# Altium schematic sheet Sheet1.SchDoc
size A3; SheetNumber: 1; SheetTotal: 1
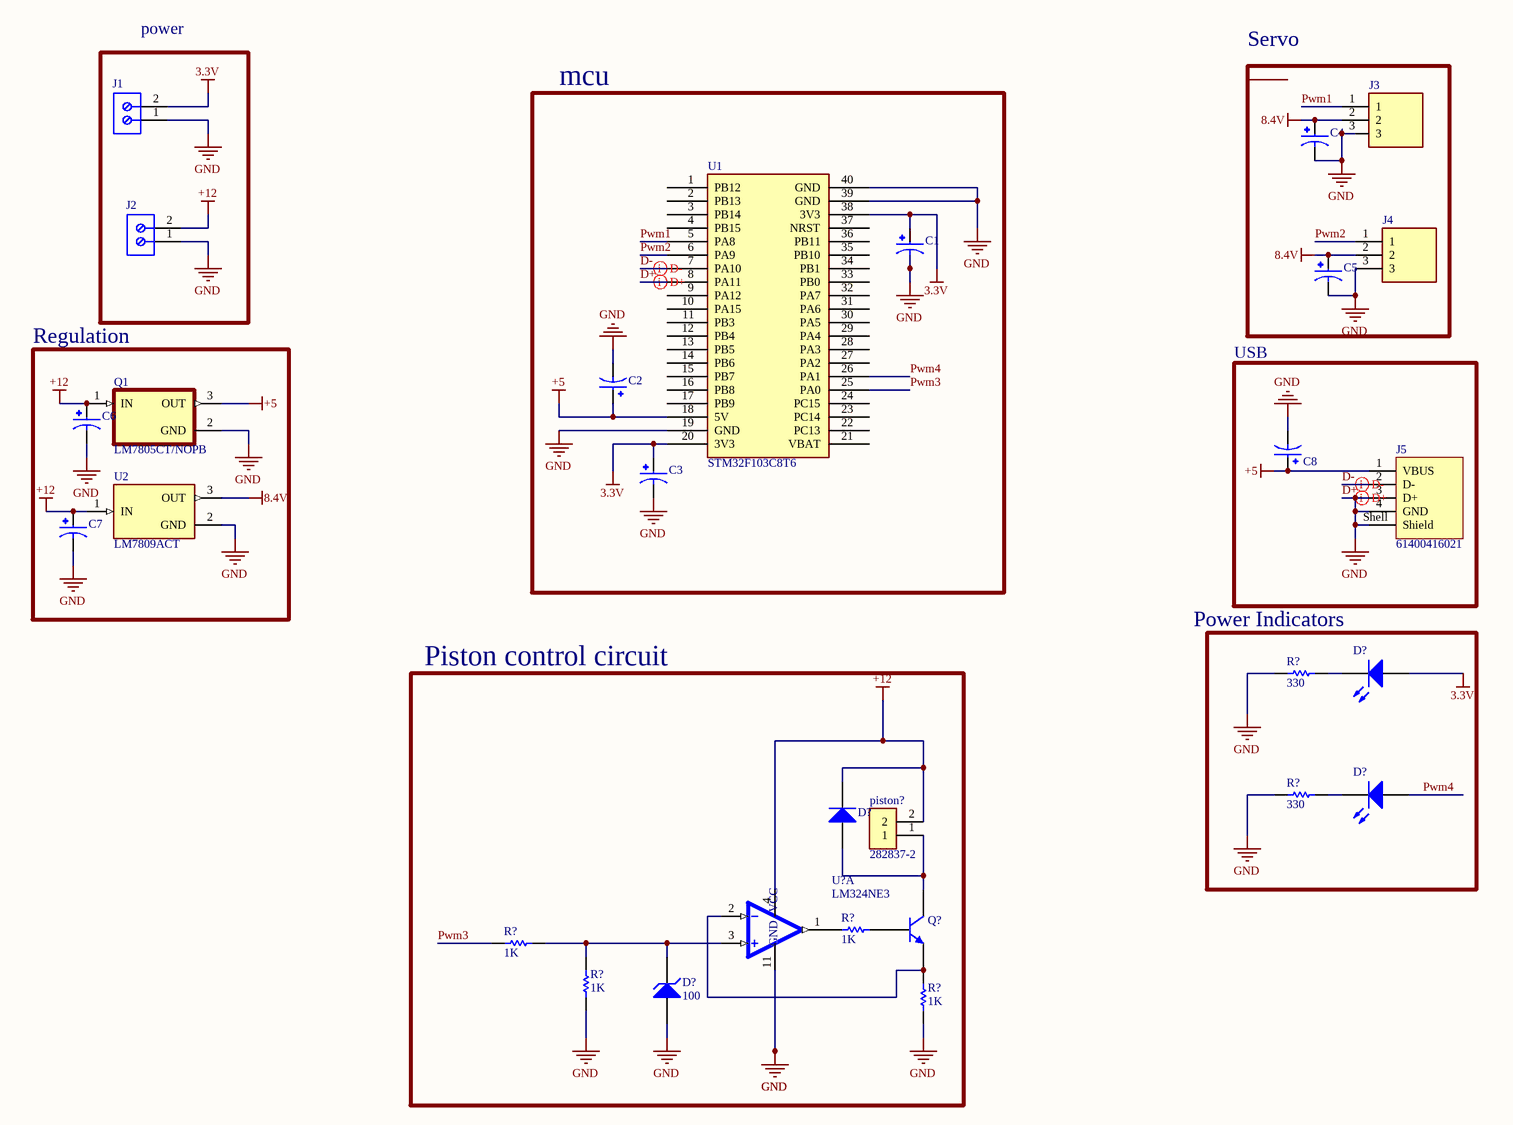
[diagram p0: Sheet1.SchDoc]

## Parts
(Parts that share a designator on the sheet are numbered #1, #2 ... from top to bottom, then left to right.)
C1  EEUFS1J270B  [CAPPRD500W50D500H1100]  (value not drawn)
C2  EEUFS1J270B  [CAPPRD500W50D500H1100]  (value not drawn)
C3  EEUFS1J270B  [CAPPRD500W50D500H1100]  (value not drawn)
C4  EEUFS1J270B  [CAPPRD500W50D500H1100]  (value not drawn)
C5  EEUFS1J270B  [CAPPRD500W50D500H1100]  (value not drawn)
C6  EEUFS1J270B  [CAPPRD500W50D500H1100]  (value not drawn)
C7  EEUFS1J270B  [CAPPRD500W50D500H1100]  (value not drawn)
C8  EEUFS1J270B  [CAPPRD500W50D500H1100]  (value not drawn)
D?#1  Light-Emitting Diode  (value not drawn)
D?#2  Light-Emitting Diode  (value not drawn)
D?#3  Diode  (value not drawn)
D?#4  BV: 100  (hidden comment: Zener Diode)
J1  691214110002  [691214110002]  (value not drawn)
J2  691214110002  [691214110002]  (value not drawn)
J3  TB006-508-03BE  [CUI_TB006-508-03BE]  (value not drawn)
J4  TB006-508-03BE  [CUI_TB006-508-03BE]  (value not drawn)
J5  61400416021  [61400416021]
piston?  282837-2  [TE_282837-2]
Q1  LM7805CT/NOPB  [TO254P1054X470X2600-3]
Q?  Bipolar NPN 3 Pins Transistor Gummel-Poon Model  (value not drawn)
R?#1  value 330  (hidden comment: Resistor)
R?#2  value 330  (hidden comment: Resistor)
R?#3  value 1K  (hidden comment: Resistor)
R?#4  value 1K  (hidden comment: Resistor)
R?#5  value 1K  (hidden comment: Resistor)
R?#6  value 1K  (hidden comment: Resistor)
U1  STM32F103C8T6  [Stm32 BluePill]
U2  LM7809ACT  [TO254P470X1016X1879-3P]
U?  LM324NE3  [DIP794W45P254L1969H508Q14]  (part A of 4)

## Blocks framed on the sheet
power: J1 J2
mcu: C1-C3 U1
Servo: C4 C5 J3 J4
Regulation: C6 C7 Q1 U2
USB: C8 J5
Piston control circuit: D?#3 D?#4 piston? Q? R?#3-R?#6 U?

## Nets
3.3V: C1.P C3.P D?#1.1(A) J1.2 U1.20(3V3) U1.38(3V3)
8.4V: C4.P C5.P J3.2 J4.2 U2.3(OUT)
+5: C2.P C8.P J5.1(VBUS) Q1.3(OUT) U1.18(5V)
+12: C6.P C7.P D?#3.2(K) J2.2 piston?.2 Q1.1(IN) U2.1(IN) U?.4(VCC)
D+: C1.N C2.N C3.N C4.N C5.N C6.N C7.N C8.N D?#4.1(A) J1.1 J2.1 J3.3 J4.3 J5.3(D+) J5.4(GND) J5.Shell(Shield) Q1.2(GND) R?#1.1 R?#2.1 R?#5.1 R?#6.1 U1.8(PA11) U1.19(GND) U1.39(GND) U1.40(GND) U2.2(GND) U?.11(GND)  [also labelled GND]
D-: J5.2(D-) U1.7(PA10)
Pwm1: J3.1 U1.5(PA8)
Pwm2: J4.1 U1.6(PA9)
Pwm3: R?#4.1 U1.25(PA0)
Pwm4: D?#2.1(A) U1.26(PA1)
NetD?#1_2: D?#1.2(K) R?#1.2
NetD?#2_2: D?#2.2(K) R?#2.2
NetD?#3_1: D?#3.1(A) piston?.1 Q?.1(C)
NetD?#4_2: D?#4.2(K) R?#4.2 R?#5.2 U?.3(1IN+)
NetQ?_2: Q?.2(B) R?#3.2
NetQ?_3: Q?.3(E) R?#6.2 U?.2(1IN-)
NetR?#3_1: R?#3.1 U?.1(1OUT)

Not connected (* = marked no-connect by the designer): U1 1(PB12) 2(PB13) 3(PB14) 4(PB15) 9(PA12) 10(PA15) 11(PB3) 12(PB4) 13(PB5) 14(PB6) 15(PB7) 16(PB8) 17(PB9) 21(VBAT) 22(PC13) 23(PC14) 24(PC15) 27(PA2) 28(PA3) 29(PA4) 30(PA5) 31(PA6) 32(PA7) 33(PB0) 34(PB1) 35(PB10) 36(PB11) 37(NRST)

## Layout directives
differential pair: D+, D-

## Notes on the sheet
- Power Indicators

## Library data of the parts
C1-C8 = EEUFS1J270B: CAP ALUM 27UF 20% 63V THRU HOLE; MP: EEU-FS1J270B; MF: Panasonic Electronic Components; Package: RADIAL-2 Panasonic; Availability: In Stock; SnapEDA_Link: https://www.snapeda.com/parts/EEU-FS1J270B/Panasonic%20Electronic%20Components/view-part/3211392/?ref=snap; Price: None; Check_prices: https://www.snapeda.com/parts/EEU-FS1J270B/Panasonic%20Electronic%20Components/view-part/3211392/?ref=eda; Value: *
D?#1 D?#2 = LED: AF: 1; BV: 0; BV_MAX: 1e99; EG: 1.11; FC: 0.5; IBV: 0.001; IS: 1e-14; MJSW: 0.33; NTUN: 30; TNOM: 27; XTI: 3; SimulationGenericComponent: True; CJO: 0; CJP: 0; CTA: 0; CTP: 0; FCS: 0.5; FV_MAX: 1e99; IKF: 0; IKR: 0; ISR: 1e-14; JSW: 0; JTUN: 0; JTUNSW: 0; KEG: 1; KF: 0; LEVEL: 1; N: 1; NBV: 1; NR: 1; NS: 1; PHP: 1; RS: 0; TCV: 0; TLEV: 0; TLEVC: 0; TM1: 0; TM2: 0; TPB: 0; TPHP: 0; TRS: 0; TRS2: 0; TT: 0; TTT1: 0; TTT2: 0; VJ: 1; XTITUN: 3
D?#3 = Diode: AF: 1; BV: 0; BV_MAX: 1e99; EG: 1.11; FC: 0.5; IBV: 0.001; ISR: 1e-14; MJSW: 0.33; NTUN: 30; TNOM: 27; XTI: 3; SimulationGenericComponent: True; CJO: 0; CJP: 0; CTA: 0; CTP: 0; FCS: 0.5; FV_MAX: 1e99; IKF: 0; IKR: 0; JSW: 0; JTUN: 0; JTUNSW: 0; KEG: 1; KF: 0; LEVEL: 1; N: 1; NBV: 1; NR: 1; NS: 1; PHP: 1; RS: 0; TCV: 0; TLEV: 0; TLEVC: 0; TM1: 0; TM2: 0; TPB: 0; TPHP: 0; TRS: 0; TRS2: 0; TT: 0; TTT1: 0; TTT2: 0; VJ: 1; XTITUN: 3; IS: 1e-14
D?#4 = Zener Diode: AF: 1; BV_MAX: 1e99; CJO: 0; EG: 1.11; FC: 0.5; IBV: 0.001; IS: 1e-14; MJSW: 0.33; NTUN: 30; TNOM: 27; XTI: 3; SimulationGenericComponent: True; CJP: 0; CTA: 0; CTP: 0; FCS: 0.5; FV_MAX: 1e99; IKF: 0; IKR: 0; ISR: 1e-14; JSW: 0; JTUN: 0; JTUNSW: 0; KEG: 1; KF: 0; LEVEL: 1; N: 1; NBV: 1; NR: 1; NS: 1; PHP: 1; RS: 0; TCV: 0; TLEV: 0; TLEVC: 0; TM1: 0; TM2: 0; TPB: 0; TPHP: 0; TRS: 0; TRS2: 0; TT: 0; TTT1: 0; TTT2: 0; VJ: 1; XTITUN: 3
J1 J2 = CMP-1502-02464-2: NexarPartId: 18818288; Plating: Brass, Steel; Current: 10A; Pitch: 3.5052mm; Number of Levels: 1; Number of Contacts: 2; Wire Gauge (Min): 16AWG; Voltage: 300V; Wire Gauge (Max): 24AWG; Stripping Length: -6mm; Number of Pins: 2; Number of Rows: 1; REACH SVHC: Unknown; RoHS: Compliant; Housing Material: Nylon; Termination: Screw; Mount: Through Hole; Contact Plating: Brass, Tin; Number of Positions Per Level: 2; Color: Blue, Green; Width: 7.9mm; Voltage Rating: 300V; Length: 7.4mm; Current Rating: 10A; Wire/Cable Gauge: 24AWG; Packaging: Box; Max Operating Temperature: 105°C; Lead Pitch: 3.5mm; Height: 8.7mm; Contact Material: Brass; Min Operating Temperature: -40°C
J3 J4 = TB006-508-03BE: 2~24 Poles, Screw Type, Horizontal, 5.08 Pitch, 26~14 (AWG), Terminal Block Connector; MF: CUI Devices; Price: None; CUI_purchase_URL: https://www.cuidevices.com/product/interconnect/connectors/terminal-blocks/tb006-508-series?utm_source=snapeda.com&utm_medium=referral&utm_campaign=snapedaBOM; Purchase-URL: https://pricing.snapeda.com/search/part/TB006-508-03BE/?ref=eda; MP: TB006-508-03BE; Value: *; Package: None; SnapEDA_Link: https://www.snapeda.com/parts/TB006-508-03BE/CUI+Devices/view-part/?ref=snap; Availability: In Stock; Check_prices: https://www.snapeda.com/parts/TB006-508-03BE/CUI+Devices/view-part/?ref=eda
J5 = CMP-1502-03227-2: NexarPartId: 21041530; Contact Resistance: 20mΩ; Gender: Receptacle; Voltage Rating (DC): 30V; Current Rating: 1.5A; Connector Type: USB; Insulation Resistance: 1GΩ; USB Standard: USB 2.0; Number of Contacts: 4; Number of Ports: 1; Width: 14.4mm; REACH SVHC: Unknown; Contact Plating: Gold; Length: 15.8mm; Lead Free: Lead Free; Max Operating Temperature: 105°C; Orientation: Horizontal; Contact Material: Copper; Voltage Rating: 30V; Min Operating Temperature: -40°C; Flammability Rating: UL94 V-0; Color: White; RoHS: Compliant; Number of Pins: 4; Mount: Horizontal, Through Hole; Number of Positions: 4; Operating Supply Voltage: 30V; Insulation Material: PBT; Termination: Solder
piston? = 282837-2: Ð Ð°Ð·ÑŠÐµÐ¼Ð½Ñ‹Ðµ ÐºÐ»ÐµÐ¼Ð¼Ð½Ñ‹Ðµ ÐºÐ¾Ð»Ð¾Ð´ÐºÐ¸ Ð Ð¾Ð·ÐµÑ‚ÐºÐ° 2 Ð¿Ð¾Ð»Ð¾Ð¶ÐµÐ½Ð¸Ñ 5,08 Ð¼Ð¼ ÐŸÑ€Ð¸Ð¿Ð¾Ð¹ Ð¿Ñ€ÑÐ¼Ð¾Ð¹ Ñ‡ÐµÑ€ÐµÐ· Ð¾Ñ‚Ð²ÐµÑ€ÑÑ‚Ð¸Ðµ 13,5 Ð / ÐºÐ¾Ð½Ñ‚Ð°ÐºÑ‚; MF: TE Connectivity; SnapEDA_Link: https://www.snapeda.com/parts/282837-2/TE+Connectivity+AMP+Connectors/view-part/?ref=snap; Price: None; Check_prices: https://www.snapeda.com/parts/282837-2/TE+Connectivity+AMP+Connectors/view-part/?ref=eda; Purchase-URL: https://pricing.snapeda.com/search/part/282837-2/?ref=eda; MP: 282837-2; Value: *; Availability: In Stock; Package: None
Q1 = LM7805CT/NOPB: Linear Voltage Regulator IC Positive Fixed 1 Output 1.5A TO-220-3; MF: ON Semiconductor; Purchase-URL: https://pricing.snapeda.com/search/part/LM7805CT/?ref=eda; Check_prices: https://www.snapeda.com/parts/LM7805CT/Onsemi/view-part/?ref=eda; SnapEDA_Link: https://www.snapeda.com/parts/LM7805CT/Onsemi/view-part/?ref=snap; Price: None; Availability: In Stock; Package: TO-220-3 ON Semiconductor; MP: LM7805CT; Value: *
Q? = BJT NPN_GP: SimulationGenericComponent: True; BF: 100; AF: 0; BR: 1; EG: 1.11; FC: 0.5; IS: 1e-16; MJC: 0.33; NC: 2; NE: 1.5; TNOM: 27; VBC_MAX: 1e99; VJC: 0.75; XTI: 3; CJC: 0; CJE: 0; CJS: 0; CTC: 0; CTE: 0; CTS: 0; IKF: 0; IKR: 0; IRB: 0; ISC: 0; ISE: 0; ISS: 0; ITF: 0; KF: 0; MJE: 0.33; MJS: 0; NF: 1; NKF: 0.5; NR: 1; NS: 1; PTF: 0; RB: 0; RBM: 0; RC: 0; RE: 0; SUBS: 1; TBF1: 0; TBF2: 0; TBR1: 0; TBR2: 0; TF: 0; TIKF1: 0; TIKF2: 0; TIKR1: 0; TIKR2: 0; TIRB1: 0; TIRB2: 0; TIS1: 0; TIS2: 0; TISC1: 0; TISC2: 0; TISE1: 0; TISE2: 0; TITF1: 0; TITF2: 0; TLEV: 0; TLEVC: 0; TMJC1: 0; TMJC2: 0; TMJE1: 0; TMJE2: 0; TMJS1: 0; TMJS2: 0; TNC1: 0; TNC2: 0; TNE1: 0; TNE2: 0; TNF1: 0; TNF2: 0; TNR1: 0; TNR2: 0; TNS1: 0; TNS2: 0; TR: 0; TRB1: 0; TRB2: 0; TRC1: 0; TRC2: 0; TRE1: 0; TRE2: 0; TRM1: 0; TRM2: 0; TTF1: 0; TTF2: 0; TTR1: 0; TTR2: 0; TVAF1: 0; TVAF2: 0; TVAR1: 0; TVAR2: 0; TVJC: 0; TVJE: 0; TVJS: 0; VAF: 0; VAR: 0; VBE_MAX: 1e99; VCE_MAX: 1e99; VJE: 0.75; VJS: 0.75; VTF: 0; XCJC: 1; XTB: 0; XTF: 0
R?#1-R?#6 = Resistor: TC1: 0; SimulationGenericComponent: True; TC2: 0
U1 = BluePill: Designed By @Alixahedi
U2 = LM7809ACT: Linear Voltage Regulator IC Positive Fixed 1 Output 1A TO-220-3; MF: ON Semiconductor; Value: *; Check_prices: https://www.snapeda.com/parts/LM7809ACT/Onsemi/view-part/?ref=eda; SnapEDA_Link: https://www.snapeda.com/parts/LM7809ACT/Onsemi/view-part/?ref=snap; Availability: In Stock; MP: LM7809ACT; Purchase-URL: https://pricing.snapeda.com/search/part/LM7809ACT/?ref=eda; Package: TO-220-3 ON Semiconductor; Price: None
U? = LM324NE3: Quad, 30-V, 1.2-MHz operational amplifier; MF: Texas Instruments; SnapEDA_Link: https://www.snapeda.com/parts/LM324NE3/Texas+Instruments/view-part/?ref=snap; Package: PDIP-14 Texas Instruments; MP: LM324NE3; Check_prices: https://www.snapeda.com/parts/LM324NE3/Texas+Instruments/view-part/?ref=eda; Purchase-URL: https://pricing.snapeda.com/search/part/LM324NE3/?ref=eda; Price: None; Value: *; Availability: In Stock